# EAGLE design incubator (EAGLE 9.6.2)
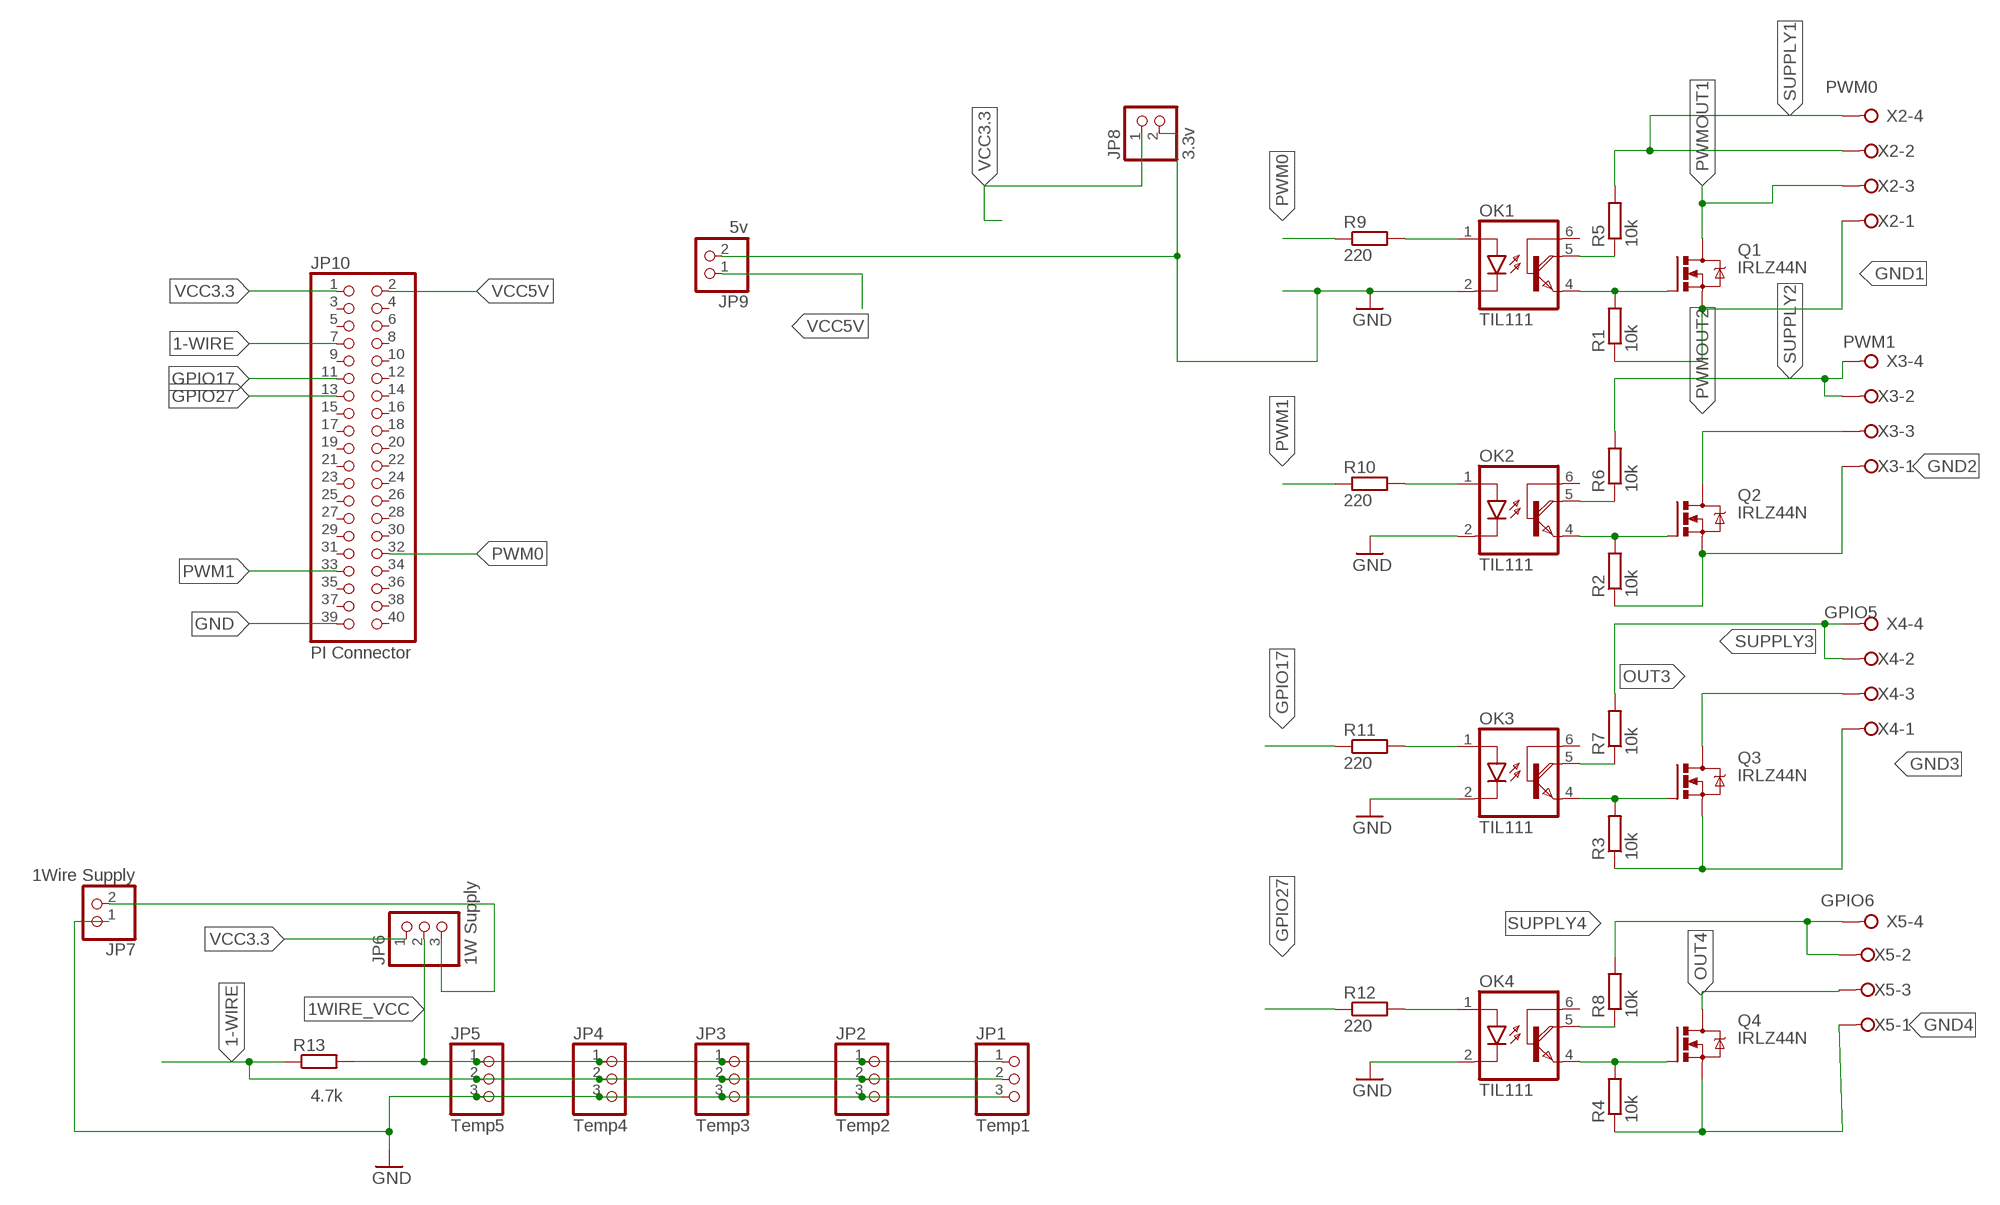
[diagram p0: schematic, sheet 1]

## Parts
JP1  Temp1  PINHD-1X3  [1X03]
JP2  Temp2  PINHD-1X3  [1X03]
JP3  Temp3  PINHD-1X3  [1X03]
JP4  Temp4  PINHD-1X3  [1X03]
JP5  Temp5  PINHD-1X3  [1X03]
JP6  1W Supply  PINHD-1X3  [1X03]
JP7  1Wire Supply  PINHD-1X2  [1X02]
JP8  3.3v  PINHD-1X2  [1X02]
JP9  5v  PINHD-1X2  [1X02]
JP10  PI Connector  PINHD-2X20  [2X20]
OK1  TIL111  4N33  [DIL06]
OK2  TIL111  4N33  [DIL06]
OK3  TIL111  4N33  [DIL06]
OK4  TIL111  4N33  [DIL06]
Q1  IRLZ44N  IRLZ44Z  [TO220BH]
Q2  IRLZ44N  IRLZ44Z  [TO220BH]
Q3  IRLZ44N  IRLZ44Z  [TO220BH]
Q4  IRLZ44N  IRLZ44Z  [TO220BH]
R1  10k  R-EU_0207/7  [0207/7]
R2  10k  R-EU_0207/7  [0207/7]
R3  10k  R-EU_0207/7  [0207/7]
R4  10k  R-EU_0207/7  [0207/7]
R5  10k  R-EU_0207/7  [0207/7]
R6  10k  R-EU_0207/7  [0207/7]
R7  10k  R-EU_0207/7  [0207/7]
R8  10k  R-EU_0207/7  [0207/7]
R9  220  R-EU_0207/7  [0207/7]
R10  220  R-EU_0207/7  [0207/7]
R11  220  R-EU_0207/7  [0207/7]
R12  220  R-EU_0207/7  [0207/7]
R13  4.7k  R-EU_0207/7  [0207/7]
X2  PWM0  W237-04P  [W237-4P]
X3  PWM1  W237-04P  [W237-4P]
X4  GPIO5  W237-04P  [W237-4P]
X5  GPIO6  W237-04P  [W237-4P]

## Nets
1-WIRE: JP1.2 JP2.2 JP3.2 JP4.2 JP5.2 JP10.7 R13.1
1WIRE_VCC: JP1.1 JP2.1 JP3.1 JP4.1 JP5.1 JP6.2 R13.2
GND: JP1.3 JP2.3 JP3.3 JP4.3 JP5.3 JP7.1 JP8.2 JP9.2 JP10.39 OK1.2(C) OK2.2(C) OK3.2(C) OK4.2(C)
GND1: Q1.S R1.1 X2.1
GND2: Q2.S R2.1 X3.1
GND3: Q3.S R3.1 X4.1
GND4: Q4.S R4.1 X5.1
GPIO17: JP10.11 R11.1
GPIO27: JP10.13 R12.1
N$1: OK1.5(COL) R5.1
N$2: OK1.4(E) Q1.G R1.2
N$3: OK2.5(COL) R6.1
N$4: OK2.4(E) Q2.G R2.2
N$5: OK3.4(E) Q3.G R3.2
N$6: OK3.5(COL) R7.1
N$7: OK4.5(COL) R8.1
N$8: OK4.4(E) Q4.G R4.2
N$12: JP6.3 JP7.2
N$13: OK1.1(A) R9.2
N$14: OK2.1(A) R10.2
N$15: OK3.1(A) R11.2
N$16: OK4.1(A) R12.2
OUT3: Q3.D X4.3
OUT4: Q4.D X5.3
PWM0: JP10.32 R9.1
PWM1: JP10.33 R10.1
PWMOUT1: Q1.D X2.3
PWMOUT2: Q2.D X3.3
SUPPLY1: R5.2 X2.2 X2.4
SUPPLY2: R6.2 X3.2 X3.4
SUPPLY3: R7.2 X4.2 X4.4
SUPPLY4: R8.2 X5.2 X5.4
VCC3.3: JP6.1 JP8.1 JP10.1
VCC5V: JP9.1 JP10.2
Unconnected: JP10.3 JP10.4 JP10.5 JP10.6 JP10.8 JP10.9 JP10.10 JP10.12 JP10.14 JP10.15 JP10.16 JP10.17 JP10.18 JP10.19 JP10.20 JP10.21 JP10.22 JP10.23 JP10.24 JP10.25 JP10.26 JP10.27 JP10.28 JP10.29 JP10.30 JP10.31 JP10.34 JP10.35 JP10.36 JP10.37 JP10.38 JP10.40 OK1.6(B) OK2.6(B) OK3.6(B) OK4.6(B)

## Library data of the parts
JP1-JP6 = pinhead:PINHD-1X3: PIN HEADER
JP7-JP9 = pinhead:PINHD-1X2: PIN HEADER
JP10 = pinhead:PINHD-2X20: PIN HEADER
OK1-OK4 = optocoupler:4N33: MOTOROLA OPTO COUPLER; MF: VISHAY/TELEFUNKEN; MPN: 4N33; OC_FARNELL: 1469601; OC_NEWARK: 88K1390
Q1-Q4 = transistor-power:IRLZ44Z: N-Channel HEXFET® Power MOSFET Logic Level AUTOMOTIVE MOSFET Source: http://www.irf.com/product-info/datasheets/data/irlz44zpbf.pdf
R1-R13 = rcl:R-EU_: RESISTOR, European symbol; SPICEPREFIX: R
X2-X5 = con-wago-508:W237-04P: WAGO SREW CLAMP; OC_FARNELL: unknown; OC_NEWARK: unknown

## Board
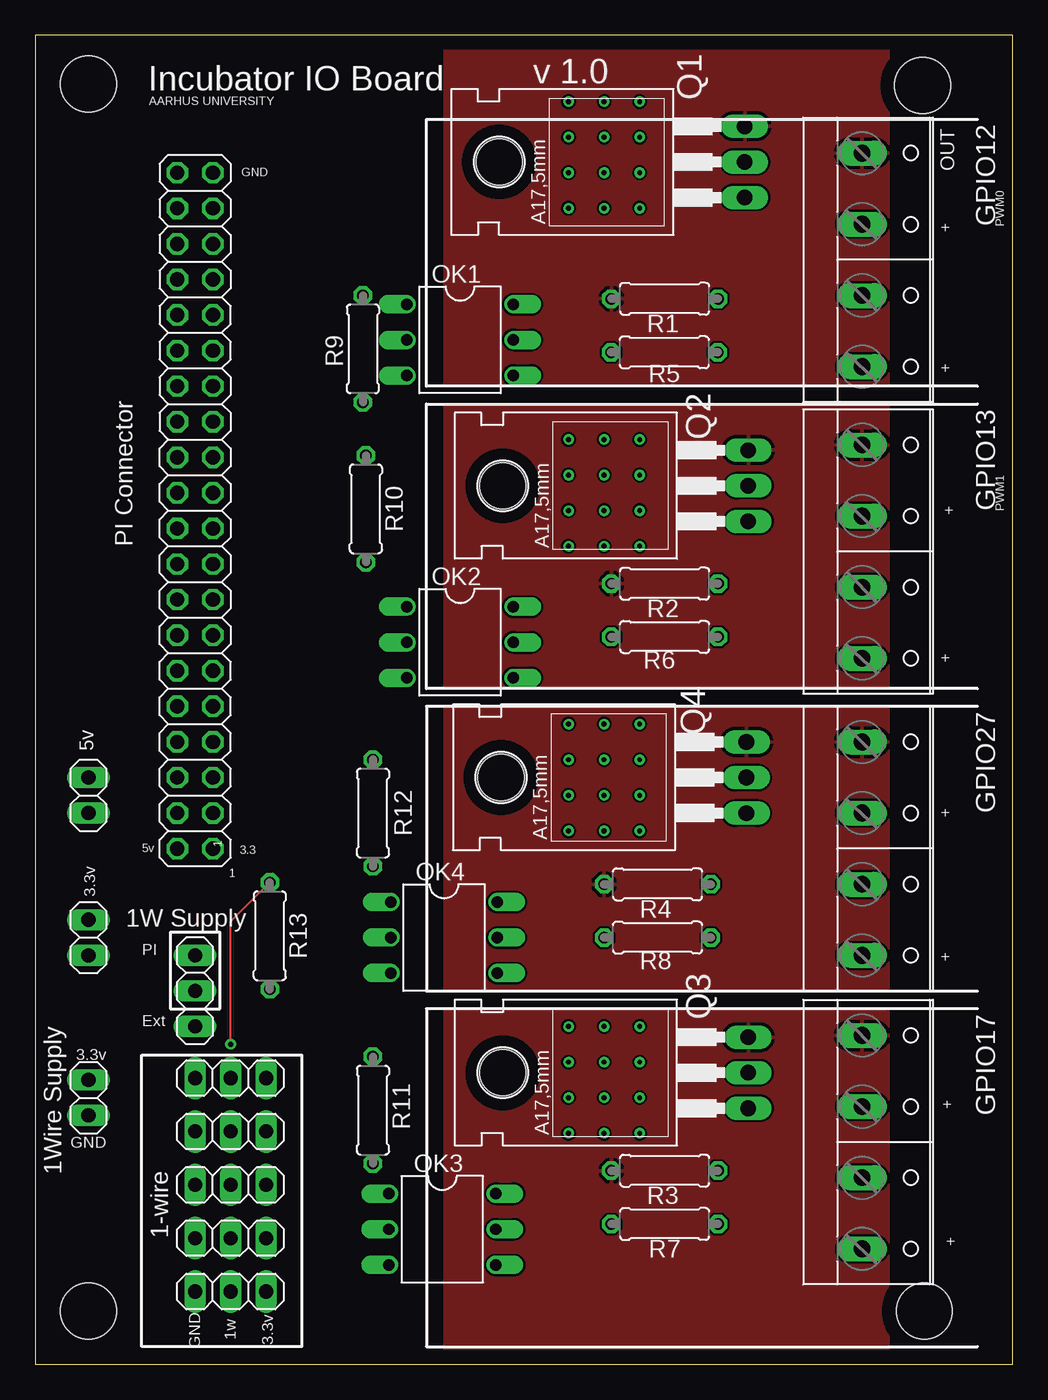
[diagram p1: board, top side]
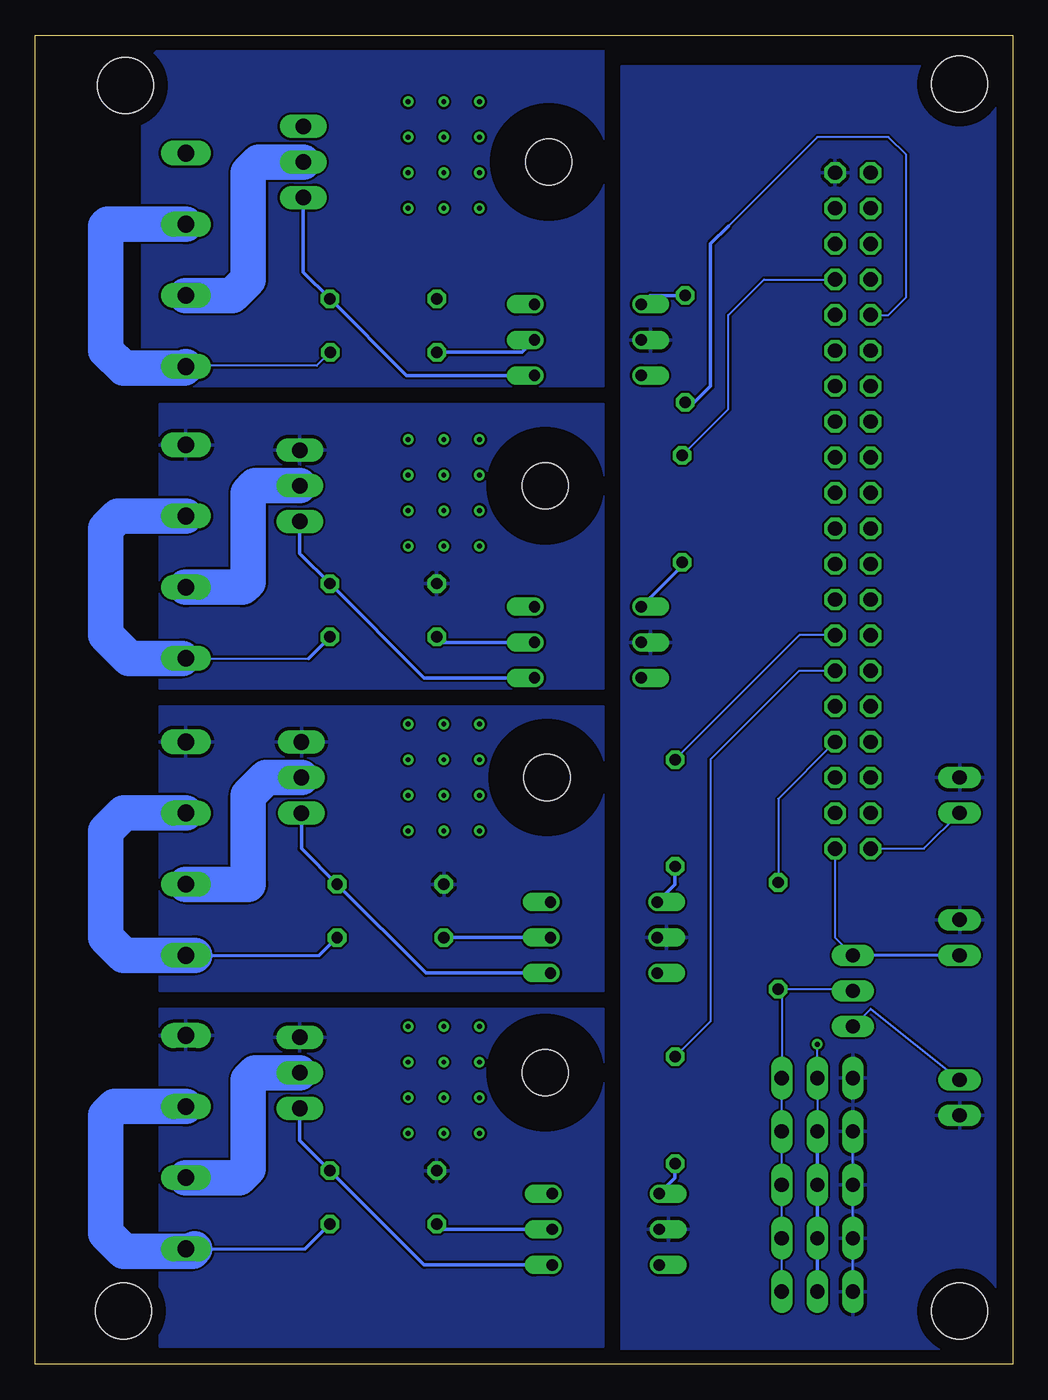
[diagram p2: board, bottom side, seen from below]

Size 69.83 x 94.92 mm. Coordinates in mm from the lower left corner, seen from the top.
Outline: 0,0 69.83,0 69.83,94.92 0,94.92 0,0
Copper layers (1*16): Top 0.035mm / dielectric 1.5mm / Bottom 0.035mm
Design rules "default": minimum track width 6mil, minimum drill 0.35mm, track to track 6mil, track to pad 6mil, pad to pad 6mil, via to via 6mil, smd to smd 6mil, copper to edge 40mil, drill to drill 6mil, minimum pad ring 10mil, minimum via ring 8mil, stop-mask expansion 4mil, vias tented up to drill 0mil, thermal gap 10mil
Holes 4 mm at 63.37,91.31 3.81,91.44 3.81,3.81 63.5,3.81

### Footprints (pad centres in the part's own frame; a part is rotated, then mirrored left to right if it is on the bottom)
1X03 = drill 1.016 long: 1 -2.54,0; 2 0,0; 3 2.54,0
1X02 = drill 1.016 long: 1 -1.27,0; 2 1.27,0
2X20 = drill 1.016 octagon: 1 -24.13,-1.27; 2 -24.13,1.27; 3 -21.59,-1.27; 4 -21.59,1.27; 5 -19.05,-1.27; 6 -19.05,1.27; 7 -16.51,-1.27; 8 -16.51,1.27; 9 -13.97,-1.27; 10 -13.97,1.27; 11 -11.43,-1.27; 12 -11.43,1.27; 13 -8.89,-1.27; 14 -8.89,1.27; 15 -6.35,-1.27; 16 -6.35,1.27; 17 -3.81,-1.27; 18 -3.81,1.27; 19 -1.27,-1.27; 20 -1.27,1.27; 21 1.27,-1.27; 22 1.27,1.27; 23 3.81,-1.27; 24 3.81,1.27; 25 6.35,-1.27; 26 6.35,1.27; 27 8.89,-1.27; 28 8.89,1.27; 29 11.43,-1.27; 30 11.43,1.27; 31 13.97,-1.27; 32 13.97,1.27; 33 16.51,-1.27; 34 16.51,1.27; 35 19.05,-1.27; 36 19.05,1.27; 37 21.59,-1.27; 38 21.59,1.27; 39 24.13,-1.27; 40 24.13,1.27
DIL06 = drill 0.813 offset: 1 -2.54,-3.81; 2 0,-3.81; 3 2.54,-3.81; 4 2.54,3.81; 5 0,3.81; 6 -2.54,3.81
TO220BH = drill 1.118 long: D 0,-6.35; G -2.54,-6.35; S 2.54,-6.35 | hole 3.302: 0,11.176
0207/7 = drill 0.813 octagon: 1 -3.81,0; 2 3.81,0
W237-4P = drill 1.194 long: 1 -7.62,-0.635; 2 -2.54,-0.635; 3 2.54,-0.635; 4 7.62,-0.635

### Placement (x,y rotation side)
JP1  13.97,5.21 180 top
JP2  13.97,9.02 180 top
JP3  13.97,12.83 180 top
JP4  13.97,16.64 180 top
JP5  13.97,20.45 180 top
JP6  11.43,26.67 270 top
JP7  3.81,19.05 90 top
JP8  3.81,30.48 90 top
JP9  3.81,40.64 90 top
JP10  11.43,60.96 90 top
OK1  30.35,73.15 270 top
OK2  30.35,51.56 270 top
OK3  29.08,9.65 270 top
OK4  29.21,30.48 270 top
Q1  44.32,85.85 90 top
Q2  44.58,62.74 90 top
Q3  44.58,20.83 90 top
Q4  44.45,41.91 90 top
R1  44.96,76.09 0 top
R2  44.96,55.75 0 top
R3  44.96,13.84 0 top
R4  44.45,34.29 0 top
R5  44.94,72.26 0 top
R6  44.96,51.94 0 top
R7  44.96,10.03 0 top
R8  44.45,30.48 0 top
R9  23.41,72.51 90 top
R10  23.62,61.09 270 top
R11  24.13,18.16 270 top
R12  24.13,39.37 270 top
R13  16.76,30.61 270 top
X2  59.69,78.87 270 top
X3  59.69,58.04 270 top
X4  59.69,15.88 270 top
X5  59.69,36.83 270 top

### Tracks (layer width: path | path; a pad name or v marks a point on that pad's centre or on a via)
1-WIRE  (via drill 0.35)
  Top 0.152: v13.97,22.86 13.97,31.62 R13.1
  Bottom 0.152: 13.97,16.51 JP5.2 v13.97,22.86 | JP10.7 16.76,40.39 R13.1
  Bottom 0.254: JP1.2 JP2.2 JP3.2 13.97,16.51 JP4.2
1WIRE_VCC
  Bottom 0.152: JP6.2 11.56,26.8 R13.2 16.51,26.54 JP5.1 JP4.1 JP3.1 JP2.1 JP1.1
GND
  Bottom 0.152: JP1.3 JP2.3 JP3.3 JP4.3
  pour Bottom: 27.94,92.71 1.27,92.71 1.27,0 27.94,0
GND0
  pour Bottom: 29.21,93.98 60.96,93.98 62.23,92.71 62.23,69.85 29.21,69.85
GND1
  pour Top: 60.96,93.98 29.21,93.98 29.21,69.85 60.96,69.85
GND2
  pour Top: 60.96,68.58 29.21,68.58 29.21,48.26 60.96,48.26
  pour Bottom: 29.21,68.58 60.96,68.58 60.96,48.26 29.21,48.26
GND3
  pour Top: 60.96,25.4 29.21,25.4 29.21,0 60.96,0
  pour Bottom: 29.21,25.4 60.96,25.4 60.96,1.27 29.21,1.27
GND4
  pour Top: 60.96,46.99 29.21,46.99 29.21,26.67 60.96,26.67
  pour Bottom: 29.21,46.99 60.96,46.99 60.96,26.67 29.21,26.67
GPIO17
  Bottom 0.152: R11.1 21.59,24.51 21.59,43.18 15.24,49.53 JP10.11
GPIO27
  Bottom 0.152: JP10.13 15.24,52.07 R12.1
N$1
  Bottom 0.254: R5.1 35.05,72.26 OK1.5
N$2
  Bottom 0.254: Q1.G 50.67,78 R1.2 43.29,70.61 OK1.4
N$3
  Bottom 0.254: OK2.5 40.77,51.56 R6.1
N$4
  Bottom 0.254: Q2.G 50.93,57.91 R2.2 42.04,49.02 OK2.4
N$5
  Bottom 0.254: Q3.G 50.93,16 R3.2 42.04,7.11 OK3.4
N$6
  Bottom 0.254: OK3.5 40.77,9.65 R7.1
N$7
  Bottom 0.254: OK4.5 R8.1
N$8
  Bottom 0.254: Q4.G 50.8,36.83 R4.2 41.91,27.94 OK4.4
N$9  (via drill 0.35)
  other vias: 38.1,90.17
N$10  (via drill 0.35)
  other vias: 40.64,90.17
N$11  (via drill 0.35)
  other vias: 43.18,90.17
N$12
  Bottom 0.152: JP6.3 10.16,25.4 JP7.2
N$13
  Bottom 0.254: OK1.1 25.91,76.32 R9.2
N$14
  Bottom 0.254: OK2.1 23.62,57.02 R10.2
N$15
  Bottom 0.254: OK3.1 24.13,13.34 R11.2
N$16
  Bottom 0.254: OK4.1 24.13,34.29 R12.2
N$17  (via drill 0.35)
  other vias: 43.18,87.63
N$18  (via drill 0.35)
  other vias: 40.64,87.63
N$19  (via drill 0.35)
  other vias: 38.1,87.63
N$20  (via drill 0.35)
  other vias: 38.1,85.09
N$21  (via drill 0.35)
  other vias: 40.64,85.09
N$22  (via drill 0.35)
  other vias: 43.18,85.09
N$23  (via drill 0.35)
  other vias: 43.18,82.55
N$24  (via drill 0.35)
  other vias: 40.64,82.55
N$25  (via drill 0.35)
  other vias: 38.1,82.55
N$26  (via drill 0.35)
  other vias: 38.1,66.04
N$27  (via drill 0.35)
  other vias: 40.64,66.04
N$28  (via drill 0.35)
  other vias: 43.18,66.04
N$29  (via drill 0.35)
  other vias: 43.18,63.5
N$30  (via drill 0.35)
  other vias: 40.64,63.5
N$31  (via drill 0.35)
  other vias: 38.1,63.5
N$32  (via drill 0.35)
  other vias: 38.1,60.96
N$33  (via drill 0.35)
  other vias: 40.64,60.96
N$34  (via drill 0.35)
  other vias: 43.18,60.96
N$35  (via drill 0.35)
  other vias: 43.18,58.42
N$36  (via drill 0.35)
  other vias: 40.64,58.42
N$37  (via drill 0.35)
  other vias: 38.1,58.42
N$38  (via drill 0.35)
  other vias: 38.1,45.72
N$39  (via drill 0.35)
  other vias: 40.64,45.72
N$40  (via drill 0.35)
  other vias: 43.18,45.72
N$41  (via drill 0.35)
  other vias: 43.18,43.18
N$42  (via drill 0.35)
  other vias: 40.64,43.18
N$43  (via drill 0.35)
  other vias: 38.1,43.18
N$44  (via drill 0.35)
  other vias: 38.1,40.64
N$45  (via drill 0.35)
  other vias: 40.64,40.64
N$46  (via drill 0.35)
  other vias: 43.18,40.64
N$47  (via drill 0.35)
  other vias: 43.18,38.1
N$48  (via drill 0.35)
  other vias: 40.64,38.1
N$49  (via drill 0.35)
  other vias: 38.1,38.1
N$50  (via drill 0.35)
  other vias: 38.1,24.13
N$51  (via drill 0.35)
  other vias: 40.64,24.13
N$52  (via drill 0.35)
  other vias: 43.18,24.13
N$53  (via drill 0.35)
  other vias: 43.18,21.59
N$54  (via drill 0.35)
  other vias: 40.64,21.59
N$55  (via drill 0.35)
  other vias: 38.1,21.59
N$56  (via drill 0.35)
  other vias: 38.1,19.05
N$57  (via drill 0.35)
  other vias: 40.64,19.05
N$58  (via drill 0.35)
  other vias: 43.18,19.05
N$59  (via drill 0.35)
  other vias: 43.18,16.51
N$60  (via drill 0.35)
  other vias: 40.64,16.51
N$61  (via drill 0.35)
  other vias: 38.1,16.51
OUT3
  Bottom 2.54: Q3.D 54.1,20.83 54.61,20.32 54.61,13.97 55.24,13.34 X4.3
OUT4
  Bottom 2.54: X5.3 54.61,34.29 54.61,40.64 53.34,41.91 Q4.D
PWM0
  Bottom 0.152: JP10.32 8.89,74.93 7.62,76.2 7.62,86.36 8.89,87.63 13.97,87.63 20.32,81.28
  Bottom 0.254: 20.32,81.28 21.59,80.01 21.59,69.85 22.74,68.7 R9.1
PWM1
  Bottom 0.152: R10.1 20.32,68.2 20.32,74.93 17.78,77.47 JP10.33
PWMOUT1
  Bottom 2.54: Q1.D 53.85,85.85 54.61,85.09 54.61,77.47 55.75,76.33 X2.3
PWMOUT2
  Bottom 2.54: Q2.D 54.1,62.74 54.61,62.23 54.61,55.88 54.99,55.5 X3.3
SUPPLY1
  Bottom 0.152: R5.2 49.71,71.3 59,71.3 59.18,71.12
  Bottom 2.54: X2.2 64.64,81.41 64.77,81.28 64.77,72.39 63.5,71.12 59.18,71.12 X2.4
SUPPLY2
  Bottom 0.152: X3.4 50.29,50.42
  Bottom 0.254: 50.29,50.42 R6.2
  Bottom 1.27: 59.31,50.42 X3.4
  Bottom 2.54: X3.2 63.88,60.58 64.77,59.69 64.77,52.07 63.12,50.42 59.31,50.42
SUPPLY3
  Bottom 0.203: X4.4 58.42,8.26 50.55,8.26
  Bottom 0.254: 50.55,8.26 R7.2
  Bottom 2.54: X4.2 64.14,18.41 64.77,17.78 64.77,9.37 63.5,8.1 58.58,8.1 58.42,8.26
SUPPLY4
  Bottom 0.203: X5.4 58.42,29.21 49.53,29.21
  Bottom 0.254: 49.53,29.21 R8.2
  Bottom 2.54: X5.2 63.5,39.37 64.77,38.1 64.77,30.48 63.5,29.21 58.42,29.21
VCC3.3
  Bottom 0.152: JP10.1 12.7,30.48 JP6.1
  Bottom 0.203: JP8.1 JP6.1
VCC5V
  Bottom 0.152: JP10.2 6.35,36.83 JP9.1

### Text on the board
tNames: Incubator IO Board | v 1.0 | AARHUS UNIVERSITY | GND | OUT | PWM0 | + | GPIO12 | + | PWM1 | + | GPIO13 | + | + | GPIO27 | 5v | 1 | 3.3 | 1 | PI | + | Ext | 3.3v | + | GPIO17 | GND | 1-wire | + | 1w | GND | 3.3v